# Altium schematic sheet BFMC_SensorProcessing.SchDoc
size A; SheetNumber: 6; SheetTotal: 7
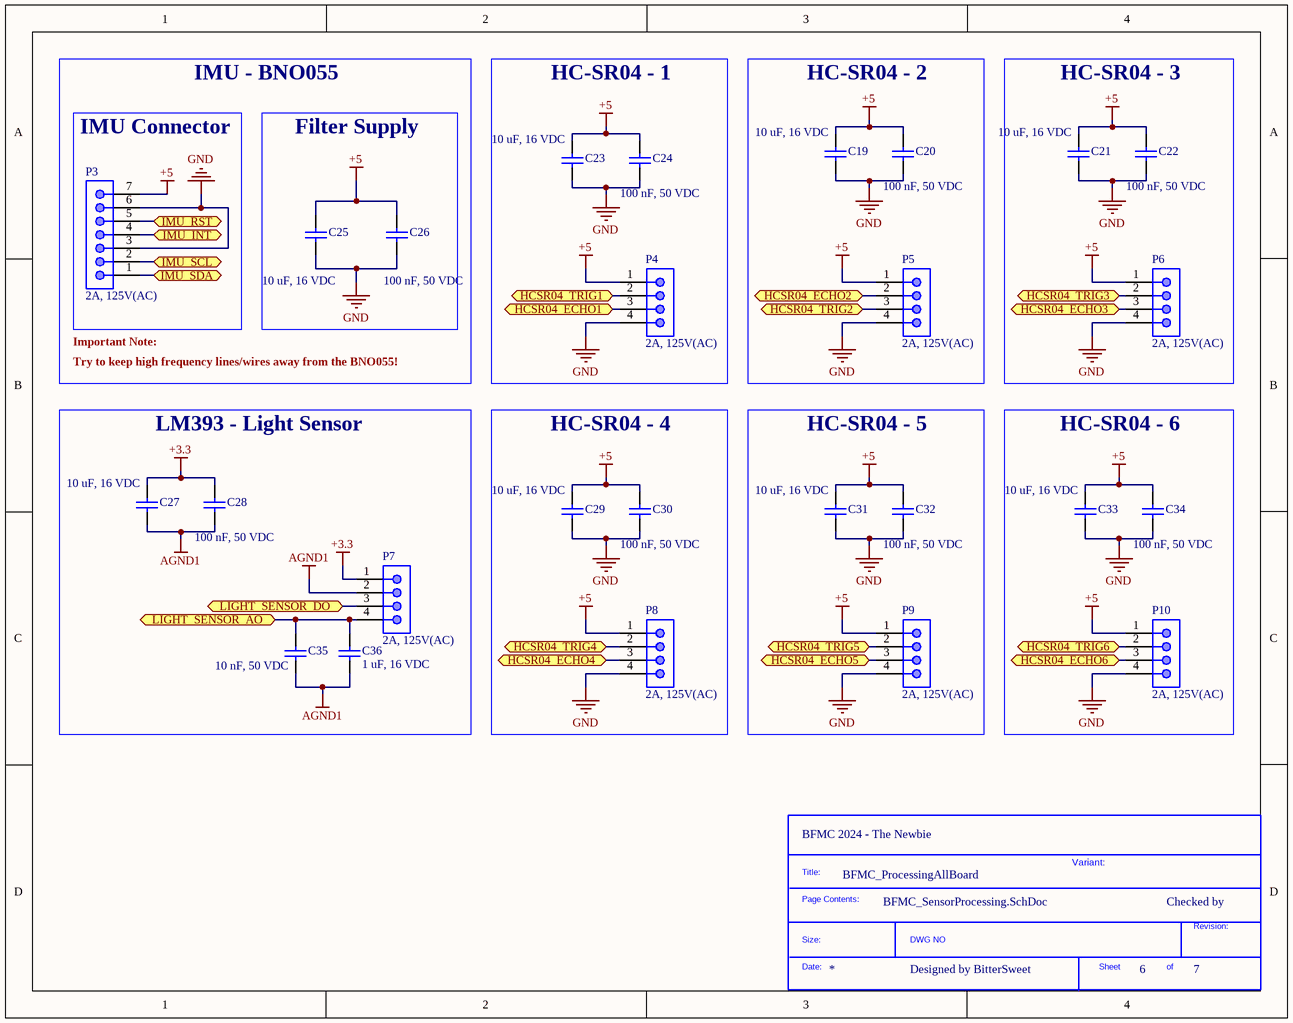
[diagram p0: BFMC_SensorProcessing.SchDoc]

## Parts
*?  SDTitleBlock  (value not drawn)  (graphical)
C19  10 uF, 16 VDC  [CAP_0805]
C20  100 nF, 50 VDC  [CAP_0805]
C21  10 uF, 16 VDC  [CAP_0805]
C22  100 nF, 50 VDC  [CAP_0805]
C23  10 uF, 16 VDC  [CAP_0805]
C24  100 nF, 50 VDC  [CAP_0805]
C25  10 uF, 16 VDC  [CAP_0805]
C26  100 nF, 50 VDC  [CAP_0805]
C27  10 uF, 16 VDC  [CAP_0805]
C28  100 nF, 50 VDC  [CAP_0805]
C29  10 uF, 16 VDC  [CAP_0805]
C30  100 nF, 50 VDC  [CAP_0805]
C31  10 uF, 16 VDC  [CAP_0805]
C32  100 nF, 50 VDC  [CAP_0805]
C33  10 uF, 16 VDC  [CAP_0805]
C34  100 nF, 50 VDC  [CAP_0805]
C35  10 nF, 50 VDC  [CAP_0805]
C36  1 uF, 16 VDC  [CAP_0805]
P3  2A, 125V(AC)  [620107131822]
P4  2A, 125V(AC)  [620104131822]
P5  2A, 125V(AC)  [620104131822]
P6  2A, 125V(AC)  [620104131822]
P7  2A, 125V(AC)  [620304124022]
P8  2A, 125V(AC)  [620104131822]
P9  2A, 125V(AC)  [620104131822]
P10  2A, 125V(AC)  [620104131822]

## Blocks framed on the sheet
HC-SR04 - 1: C23 C24 P4
HC-SR04 - 2: C19 C20 P5
HC-SR04 - 3: C21 C22 P6
IMU Connector: P3
Filter Supply: C25 C26
LM393 - Light Sensor: C27 C28 C35 C36 P7
HC-SR04 - 4: C29 C30 P8
HC-SR04 - 5: C31 C32 P9
HC-SR04 - 6: C33 C34 P10

## Ports
HCSR04_ECHO1 (bidir), HCSR04_ECHO2 (bidir), HCSR04_ECHO3 (bidir), HCSR04_ECHO4 (bidir), HCSR04_ECHO5 (bidir), HCSR04_ECHO6 (bidir), HCSR04_TRIG1 (bidir), HCSR04_TRIG2 (bidir), HCSR04_TRIG3 (bidir), HCSR04_TRIG4 (bidir), HCSR04_TRIG5 (bidir), HCSR04_TRIG6 (bidir), IMU_INT (bidir), IMU_RST (bidir), IMU_SCL (bidir), IMU_SDA (bidir), LIGHT_SENSOR_AO (bidir), LIGHT_SENSOR_DO (bidir)

## Nets
+3.3: C27.2 C28.2 P7.1
+5: C19.2 C20.2 C21.2 C22.2 C23.2 C24.2 C25.2 C26.2 C29.2 C30.2 C31.2 C32.2 C33.2 C34.2 P3.7 P4.1 P5.1 P6.1 P8.1 P9.1 P10.1
AGND1: C27.1 C28.1 C35.1 C36.1 P7.2
GND: C19.1 C20.1 C21.1 C22.1 C23.1 C24.1 C25.1 C26.1 C29.1 C30.1 C31.1 C32.1 C33.1 C34.1 P3.3 P3.6 P4.4 P5.4 P6.4 P8.4 P9.4 P10.4
HCSR04_ECHO1: P4.3 ; port HCSR04_ECHO1
HCSR04_ECHO2: P5.2 ; port HCSR04_ECHO2
HCSR04_ECHO3: P6.3 ; port HCSR04_ECHO3
HCSR04_ECHO4: P8.3 ; port HCSR04_ECHO4
HCSR04_ECHO5: P9.3 ; port HCSR04_ECHO5
HCSR04_ECHO6: P10.3 ; port HCSR04_ECHO6
HCSR04_TRIG1: P4.2 ; port HCSR04_TRIG1
HCSR04_TRIG2: P5.3 ; port HCSR04_TRIG2
HCSR04_TRIG3: P6.2 ; port HCSR04_TRIG3
HCSR04_TRIG4: P8.2 ; port HCSR04_TRIG4
HCSR04_TRIG5: P9.2 ; port HCSR04_TRIG5
HCSR04_TRIG6: P10.2 ; port HCSR04_TRIG6
IMU_INT: P3.4 ; port IMU_INT
IMU_RST: P3.5 ; port IMU_RST
IMU_SCL: P3.2 ; port IMU_SCL
IMU_SDA: P3.1 ; port IMU_SDA
LIGHT_SENSOR_AO: C35.2 C36.2 P7.4 ; port LIGHT_SENSOR_AO
LIGHT_SENSOR_DO: P7.3 ; port LIGHT_SENSOR_DO

## Notes on the sheet
- IMU - BNO055
- Important Note:
- Try to keep high frequency lines/wires away from the BNO055!
- (near *?) BFMC 2024 - The Newbie
- BFMC_ProcessingAllBoard
- Variant:
- Checked by
- Designed by BitterSweet
- (in symbol SDTitleBlock) Title:; Page Contents:; Revision:; Size:; DWG NO; Date:; Sheet; of

## Library data of the parts
C19 C21 C23 C25 C27 C29 C31 C33 = 0108051061016: CAP, size 0805, 10 uF, 16 VDC; Manufacture Name: TDK; Manufacture SN: CGA4J1X7S1C106K125AE; Capacitance: 10 uF; Tolerance: +/-10%; Voltage Rating DC: 16 VDC; ComponentLink2Description: Datasheet; ComponentLink2URL: https://product.tdk.com/system/files/dam/doc/product/capacitor/ceramic/mlcc/catalog/mlcc_automotive_soft_en.pdf?ref_disty=mouser; Operating Temperature: -55 to +125degC; Packaging: Tape and Reel; Mounting Technology: SMT; Size: 0805; Supplier 1 Name: Mouser; Supplier 1 SN: 810-CGA4J1X7S1C106KA; Supplier 1 URL: https://www.mouser.vn/ProductDetail/TDK/CGA4J1X7S1C106K125AE?qs=nQSIdc08i%252Bda5YDbrVYncg%3D%3D&utm_source=mouser-refine-download&utm_medium=file&utm_campaign=CGA4J1X7S1C106K125AE&utm_content=TDK; Supplier 2 Name: Digi-Key; Supplier 2 SN: 445-173674-2-ND; Supplier 2 URL: https://www.digikey.com/en/products/detail/tdk-corporation/cga4j1x7s1c106k125ae/5809239; Supplier 3 Name: thegioiic; Supplier 3 SN: OEM; Supplier 3 URL: https://www.thegioiic.com/tu-gom-0805-10uf-16v; Value: 10 uF, 16 VDC
C20 C22 C24 C26 C28 C30 C32 C34 = 0108051031050: CAP, size 0805, 100 nF, 50 VDC; Manufacture Name: TDK; Manufacture SN: CGA4C2C0G1H103J060AA; Capacitance: 100 nF; Tolerance: +/-5%; Voltage Rating DC: 50 VDC; ComponentLink2Description: Datasheet; ComponentLink2URL: https://product.tdk.com/system/files/dam/doc/product/capacitor/ceramic/mlcc/catalog/mlcc_automotive_general_en.pdf?ref_disty=mouser; Operating Temperature: -55 to +125degC; Packaging: Tape and Reel; Mounting Technology: SMT; Size: 0805; Supplier 1 Name: Mouser; Supplier 1 SN: 810-CGA4C2C0G1H103J; Supplier 1 URL: https://www.mouser.vn/ProductDetail/TDK/CGA4C2C0G1H103J060AA?qs=FxQuwy19cyC9M6v0nMqjhA%3D%3D&utm_source=mouser-refine-download&utm_medium=file&utm_campaign=CGA4C2C0G1H103J060AA&utm_content=TDK; Supplier 2 Name: Digi-Key; Supplier 2 SN: 445-6947-2-ND; Supplier 2 URL: https://www.digikey.com/en/products/detail/tdk-corporation/cga4c2c0g1h103j060aa/2672840; Supplier 3 Name: thegioiic; Supplier 3 SN: OEM; Supplier 3 URL: https://www.thegioiic.com/tu-gom-0805-100nf-0-1uf-50v; Value: 100 nF, 50 VDC
C35 = 0108051031050: CAP, size 0805, 10 nF, 50 VDC; Manufacture Name: TDK; Manufacture SN: CGA4C2C0G1H103J060AA; Capacitance: 10 nF; Tolerance: +/-5%; Voltage Rating DC: 50 VDC; ComponentLink2Description: Datasheet; ComponentLink2URL: https://product.tdk.com/system/files/dam/doc/product/capacitor/ceramic/mlcc/catalog/mlcc_automotive_general_en.pdf?ref_disty=mouser; Operating Temperature: -55 to +125degC; Packaging: Tape and Reel; Mounting Technology: SMT; Size: 0805; Supplier 1 Name: Mouser; Supplier 1 SN: 810-CGA4C2C0G1H103J; Supplier 1 URL: https://www.mouser.vn/ProductDetail/TDK/CGA4C2C0G1H103J060AA?qs=FxQuwy19cyC9M6v0nMqjhA%3D%3D&utm_source=mouser-refine-download&utm_medium=file&utm_campaign=CGA4C2C0G1H103J060AA&utm_content=TDK; Supplier 2 Name: Digi-Key; Supplier 2 SN: 445-6947-2-ND; Supplier 2 URL: https://www.digikey.com/en/products/detail/tdk-corporation/cga4c2c0g1h103j060aa/2672840; Supplier 3 Name: thegioiic; Supplier 3 SN: OEM; Supplier 3 URL: https://www.thegioiic.com/tu-gom-0805-10nf-50v; Value: 10 nF, 50 VDC
C36 = 0108051051016: CAP, size 0805, 1 uF, 16 VDC; Manufacture Name: TDK; Manufacture SN: CGA4J2X7R1C105K125AA; Capacitance: 1 uF; Tolerance: +/-10%; Voltage Rating DC: 16 VDC; ComponentLink2Description: Datasheet; ComponentLink2URL: https://product.tdk.com/system/files/dam/doc/product/capacitor/ceramic/mlcc/catalog/mlcc_automotive_general_en.pdf?ref_disty=mouser; Operating Temperature: -55 to +125degC; Packaging: Tape and Reel; Mounting Technology: SMT; Size: 0805; Supplier 1 Name: Mouser; Supplier 1 SN: 810-CGA4J2X7R1C105K; Supplier 1 URL: https://www.mouser.vn/ProductDetail/TDK/CGA4J2X7R1C105K125AA?qs=NRhsANhppD8sFjo%252B1TQuCQ%3D%3D&utm_source=mouser-refine-download&utm_medium=file&utm_campaign=CGA4J2X7R1C105K125AA&utm_content=TDK; Supplier 2 Name: Digi-Key; Supplier 2 SN: 445-5689-2-ND; Supplier 2 URL: https://www.digikey.com/en/products/detail/tdk-corporation/cga4j2x7r1c105k125aa/2443167; Supplier 3 Name: thegioiic; Supplier 3 SN: OEM; Supplier 3 URL: https://www.thegioiic.com/tu-gom-0805-1uf-16v; Value: 1 uF, 16 VDC
P3 = 620107131822: WR-WTB SMT Male Horizontal Shrouded Header, pitch 2mm, 7p; Pin Number: 7; Contact Resistance: 20mOhm; Withstanding Voltage: 800VAC; Working Voltage: 100VAC; ComponentLink1Description: Manufacturer; ComponentLink1URL: http://www.we-online.de; ComponentLink2Description: Datasheet; ComponentLink2URL: https://www.we-online.com/catalog/datasheet/620107131822.pdf; Pitch: 2mm; Published Date: January 2020; Publisher: Wurth Elektronik; Mounting Technology: SMT; Packaging: Tape and Reel; Operating Temperature: -25 to +85degC; Part Number: 620107131822; Gender: Male; Type: Horizontal; Rated Current: 2A; ComponentLink3Description: Global Supply; ComponentLink3URL: https://www.we-online.com/en/components/products/WTB_2_00_SMT_MALE_HORIZONTAL_SHROUDED_HEADER_6201XX131822?sq=620107131822#620107131822; Supplier 1 Name: Mouser; Supplier 1 SN: N/A; Supplier 1 URL: N/A; Supplier 2 Name: Digi-Key; Supplier 2 SN: N/A; Supplier 2 URL: N/A; Supplier 3 Name: thegioiic; Supplier 3 SN: N/A; Supplier 3 URL: https://www.thegioiic.com/dau-ph2-0mm-7-chan-dan-smd-nam-ngang; Value: 2A, 125V(AC)
P4-P6 P8-P10 = 620104131822: WR-WTB SMT Male Horizontal Shrouded Header, pitch 2mm, 4p; Pin Number: 4; Contact Resistance: 20mOhm; Withstanding Voltage: 800VAC; Working Voltage: 100VAC; ComponentLink1Description: Manufacturer; ComponentLink1URL: http://www.we-online.de; ComponentLink2Description: Datasheet; ComponentLink2URL: https://www.we-online.com/catalog/datasheet/620104131822.pdf; Pitch: 2mm; Published Date: January 2020; Publisher: Wurth Elektronik; Mounting Technology: SMT; Packaging: Tape and Reel; Operating Temperature: -25 to +85degC; Part Number: 620104131822; Gender: Male; Type: Horizontal; Rated Current: 2A; ComponentLink3Description: Global Supply; ComponentLink3URL: https://www.we-online.com/en/components/products/WTB_2_00_SMT_MALE_HORIZONTAL_SHROUDED_HEADER_6201XX131822?sq=620104131822#620104131822; ComponentLink4Description: Global Supply; ComponentLink4URL: https://www.mouser.vn/ProductDetail/Wurth-Elektronik/620104131822?qs=ZtY9WdtwX57A7D%2FbILyVEQ%3D%3D; Supplier 1 Name: Mouser; Supplier 1 SN: 710-620104131822; Supplier 1 URL: https://www.mouser.vn/ProductDetail/Wurth-Elektronik/620104131822?qs=ZtY9WdtwX57A7D%2FbILyVEQ%3D%3D; Supplier 2 Name: Digi-Key; Supplier 2 SN: N/A; Supplier 2 URL: N/A; Supplier 3 Name: thegioiic; Supplier 3 SN: N/A; Supplier 3 URL: https://www.thegioiic.com/dau-ph2-0mm-4-chan-dan-smd-nam-ngang; Value: 2A, 125V(AC)
P7 = 620304124022: WR-WTB SMT Male Vertical Shrouded Header, pitch 2mm, 4p; Pin Number: 4; Contact Resistance: 20mOhm; Withstanding Voltage: 800VAC; Working Voltage: 100VAC; ComponentLink1Description: Manufacturer; ComponentLink1URL: http://www.we-online.de; ComponentLink2Description: Datasheet; ComponentLink2URL: https://www.we-online.com/catalog/datasheet/620304124022.pdf; Pitch: 2mm; Published Date: January 2020; Publisher: Wurth Elektronik; Mounting Technology: SMT; Packaging: Tape and Reel; Operating Temperature: -25 to +85degC; Part Number: 620304124022; Gender: Male; Type: Vertical; Rated Current: 2A; ComponentLink3Description: Global Supply; ComponentLink3URL: https://www.we-online.com/en/components/products/WTB_2_00_SMT_MALE_VERTICAL_SHROUDED_HEADER_6203XX124022?sq=620304124022#620304124022; ComponentLink4Description: Global Supply; ComponentLink4URL: https://www.mouser.vn/ProductDetail/Wurth-Elektronik/620304124022?qs=ZtY9WdtwX5729BhN8GzI6w%3D%3D; Supplier 1 Name: Mouser; Supplier 1 SN: 710-620304124022; Supplier 1 URL: https://www.mouser.vn/ProductDetail/Wurth-Elektronik/620304124022?qs=ZtY9WdtwX5729BhN8GzI6w%3D%3D; Supplier 2 Name: Digi-Key; Supplier 2 SN: N/A; Supplier 2 URL: N/A; Supplier 3 Name: thegioiic; Supplier 3 SN: N/A; Supplier 3 URL: https://www.thegioiic.com/dau-hy2-0mm-4-chan-dan-smd-thang-dung; Value: 2A, 125V(AC)